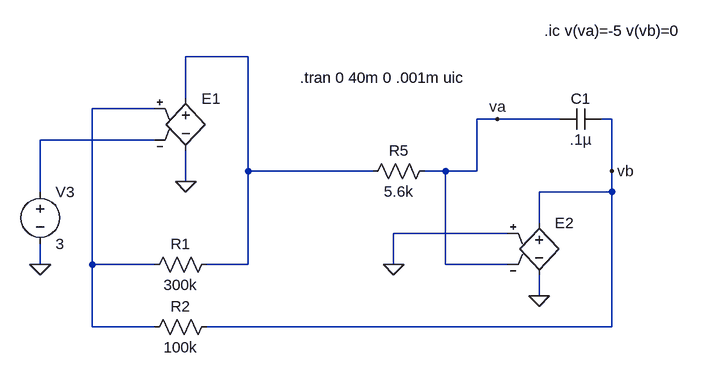
[diagram p0: schematic triangular2.asc]
triangular2.asc, the LTspice schematic file:
Version 4
SHEET 1 1188 680
WIRE 304 -48 208 -48
WIRE 208 16 208 -48
WIRE 160 32 64 32
WIRE 688 48 656 48
WIRE 784 48 688 48
WIRE 864 48 848 48
WIRE 160 80 -16 80
WIRE 304 128 304 -48
WIRE 496 128 304 128
WIRE 608 128 576 128
WIRE 656 128 656 48
WIRE 656 128 608 128
WIRE 864 128 864 48
WIRE 208 144 208 96
WIRE -16 160 -16 80
WIRE 864 160 864 128
WIRE 864 160 752 160
WIRE 752 208 752 160
WIRE 704 224 528 224
WIRE -16 272 -16 240
WIRE 64 272 64 32
WIRE 160 272 64 272
WIRE 304 272 304 128
WIRE 304 272 240 272
WIRE 528 272 528 224
WIRE 608 272 608 128
WIRE 704 272 608 272
WIRE 752 320 752 288
WIRE 64 368 64 272
WIRE 160 368 64 368
WIRE 864 368 864 160
WIRE 864 368 240 368
FLAG -16 272 0
FLAG 208 144 0
FLAG 752 320 0
FLAG 528 272 0
FLAG 688 48 va
FLAG 864 128 vb
SYMBOL res 592 112 R90
WINDOW 0 0 56 VBottom 2
WINDOW 3 32 56 VTop 2
SYMATTR InstName R5
SYMATTR Value 5.6k
SYMBOL cap 848 32 R90
WINDOW 0 0 32 VBottom 2
WINDOW 3 32 32 VTop 2
SYMATTR InstName C1
SYMATTR Value .1µ
SYMBOL res 256 256 R90
WINDOW 0 0 56 VBottom 2
WINDOW 3 32 56 VTop 2
SYMATTR InstName R1
SYMATTR Value 300k
SYMBOL res 256 352 R90
WINDOW 0 0 56 VBottom 2
WINDOW 3 32 56 VTop 2
SYMATTR InstName R2
SYMATTR Value 100k
SYMBOL voltage -16 144 R0
WINDOW 123 0 0 Left 2
WINDOW 39 0 0 Left 2
SYMATTR InstName V3
SYMATTR Value 3
SYMBOL e 208 0 R0
WINDOW 3 24 96 Invisible 2
SYMATTR Value table=(-100,-12)(-50u,-12)(50u,12)(100,12)
SYMATTR InstName E1
SYMBOL e 752 192 R0
WINDOW 3 24 96 Invisible 2
SYMATTR Value table=(-100,-12)(-50u,-12)(50u,12)(100,12)
SYMATTR InstName E2
TEXT 384 -16 Left 2 !.tran 0 40m 0 .001m uic
TEXT 760 -88 Left 2 !.ic v(va)=-5 v(vb)=0

The netlist it stands for:
* triangular2.asc
R5 va N001 5.6k
C1 vb va .1µ
R1 N001 N002 300k
R2 vb N002 100k
V3 N003 0 3
E1 N001 0 N002 N003 table=(-100,-12)(-50u,-12)(50u,12)(100,12)
E2 vb 0 0 va table=(-100,-12)(-50u,-12)(50u,12)(100,12)
.tran 0 40m 0 .001m uic
.ic v(va)=-5 v(vb)=0
.backanno
.end